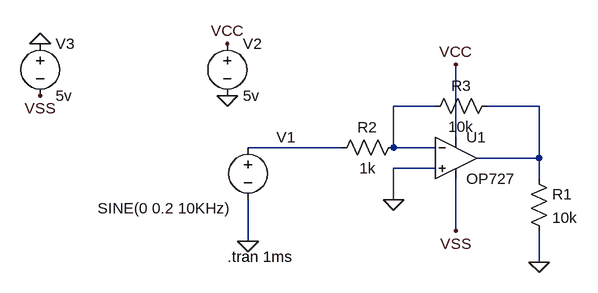
[diagram p0: schematic 6432106821-PB2.asc]
6432106821-PB2.asc, the LTspice schematic file:
Version 4
SHEET 1 880 680
WIRE 16 48 -48 48
WIRE 176 48 96 48
WIRE 48 96 48 -16
WIRE -128 112 -272 112
WIRE -48 112 -48 48
WIRE 16 112 -48 112
WIRE 176 128 176 48
WIRE 176 128 80 128
WIRE 16 144 -48 144
WIRE 176 160 176 128
WIRE -48 192 -48 144
WIRE 48 240 48 160
WIRE -272 256 -272 192
WIRE 176 288 176 240
FLAG 176 288 0
FLAG -272 256 0
FLAG 48 -16 VCC
FLAG -304 -48 VCC
FLAG -304 32 0
FLAG -48 192 0
FLAG 48 240 VSS
FLAG -592 -48 0
FLAG -592 32 VSS
SYMBOL res 160 144 R0
SYMATTR InstName R1
SYMATTR Value 10k
SYMBOL voltage -272 96 R0
WINDOW 123 0 0 Left 0
WINDOW 39 0 0 Left 0
WINDOW 0 44 0 Left 2
WINDOW 3 -232 109 Left 2
SYMATTR InstName V1
SYMATTR Value SINE(0 0.2 10KHz)
SYMBOL voltage -304 -64 R0
WINDOW 123 0 0 Left 0
WINDOW 39 0 0 Left 0
SYMATTR InstName V2
SYMATTR Value 5v
SYMBOL Opamps\\OP727 48 64 R0
SYMATTR InstName U1
SYMBOL res -32 96 R90
WINDOW 0 0 56 VBottom 2
WINDOW 3 32 56 VTop 2
SYMATTR InstName R2
SYMATTR Value 1k
SYMBOL res 112 32 R90
WINDOW 0 0 56 VBottom 2
WINDOW 3 32 56 VTop 2
SYMATTR InstName R3
SYMATTR Value 10k
SYMBOL voltage -592 -64 R0
WINDOW 123 0 0 Left 0
WINDOW 39 0 0 Left 0
SYMATTR InstName V3
SYMATTR Value 5v
TEXT -304 280 Left 2 !.tran 1ms

The netlist it stands for:
* 6432106821-PB2.asc
R1 N002 0 10k
V1 N003 0 SINE(0 0.2 10KHz)
V2 VCC 0 5v
XU1 0 N001 VCC VSS N002 OP727  ; pins In+ In- V+ V- OUT
R2 N001 N003 1k
R3 N002 N001 10k
V3 0 VSS 5v
.tran 1ms
.backanno
.end